# EAGLE design BPW5017-VGA (EAGLE 5.06)
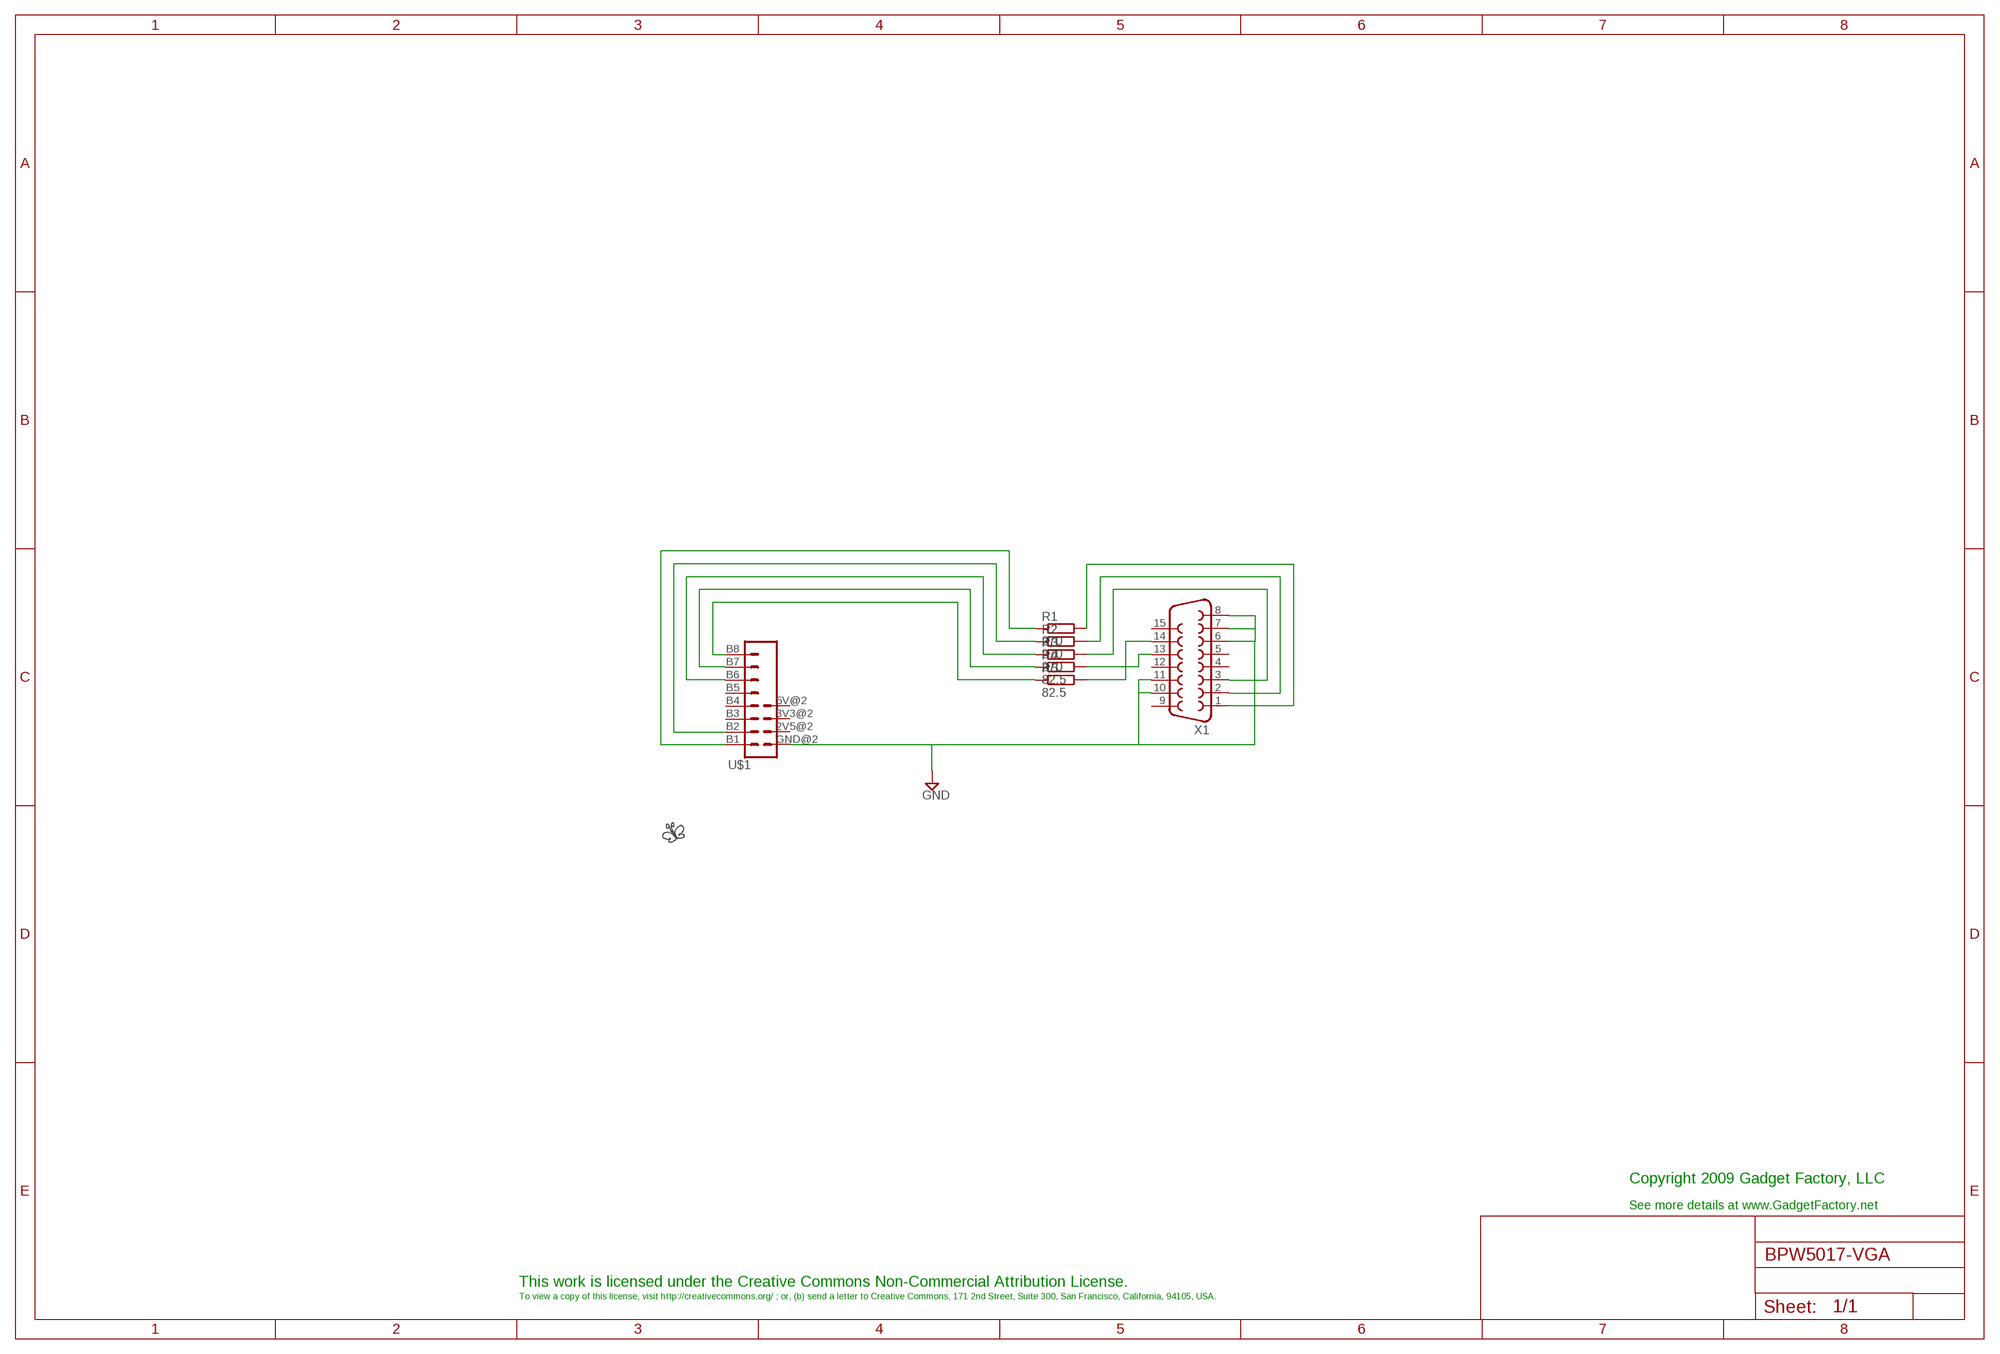
[diagram p0: schematic, sheet 1]

## Parts
LOGO2  BUTTERFLY_LOGO  [BUTTERFLY_LOGO]
R1  270  R-EU_0207/10  [0207/10]
R2  270  R-EU_0207/10  [0207/10]
R3  270  R-EU_0207/10  [0207/10]
R4  82.5  R-EU_0207/10  [0207/10]
R5  82.5  R-EU_0207/10  [0207/10]
U$1  WING_8BIT  [WINGSIDE_8BIT]
X1  F15HDH  [HDF15H]

## Nets
GND: U$1.GND@2(GND) X1.6 X1.7 X1.8 X1.10 X1.11
N$1: R1.2 X1.1
N$2: R2.2 X1.2
N$3: R3.2 X1.3
N$4: R4.2 X1.13
N$5: R5.2 X1.14
N$6: R1.1 U$1.B1
N$7: R2.1 U$1.B2
N$8: R3.1 U$1.B6
N$9: R4.1 U$1.B7
N$12: R5.1 U$1.B8
Unconnected: U$1.2V5@2(2V5) U$1.3V3@2(3V3) U$1.5V@2(5V) U$1.B3 U$1.B4 U$1.B5 X1.4 X1.5 X1.9 X1.12 X1.15

## Notes on the sheet
- Copyright 2009 Gadget Factory, LLC
- See more details at www.GadgetFactory.net
- This work is licensed under the Creative Commons Non-Commercial Attribution License.
- To view a copy of this license, visit http://creativecommons.org/ ; or, (b) send a letter to Creative Commons, 171 2nd Street, Suite 300, San Francisco, California, 94105, USA.

## Library data of the parts
LOGO2 = GadgetFactory_Pub:BUTTERFLY_LOGO
R1-R5 = resistor:R-EU_: RESISTOR, European symbol
U$1 = GadgetFactory_Pub:WING_8BIT
X1 = con-subd:F15: SUB-D

## Board
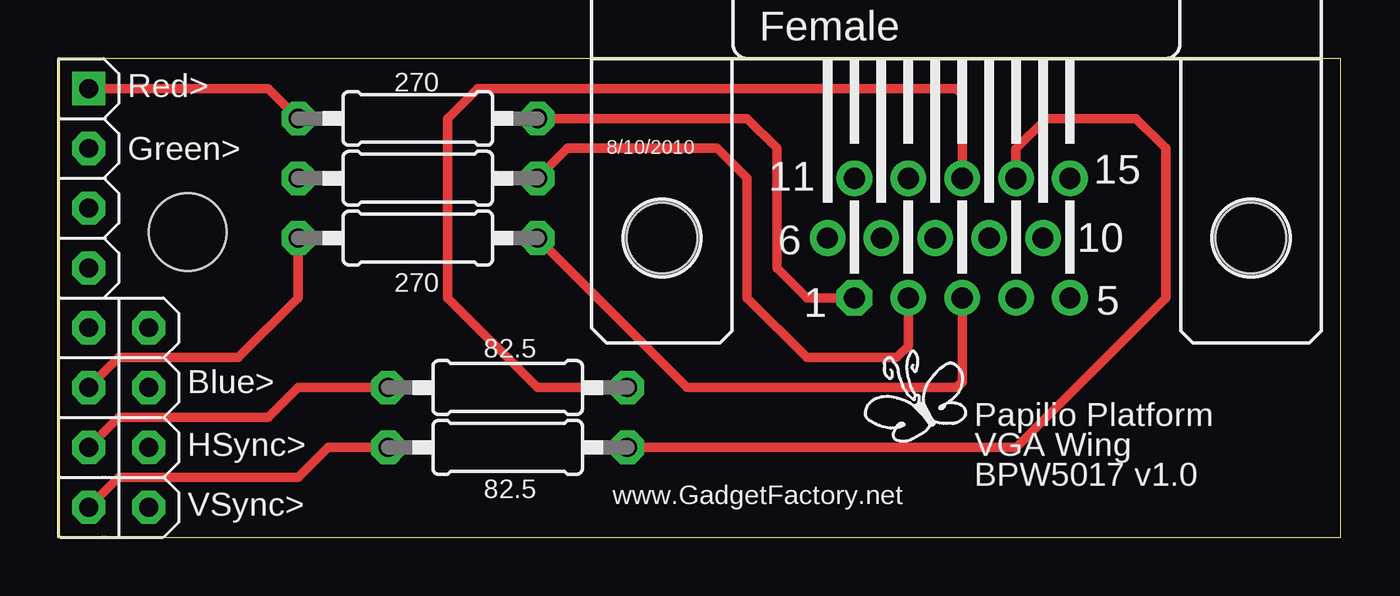
[diagram p1: board, top side]
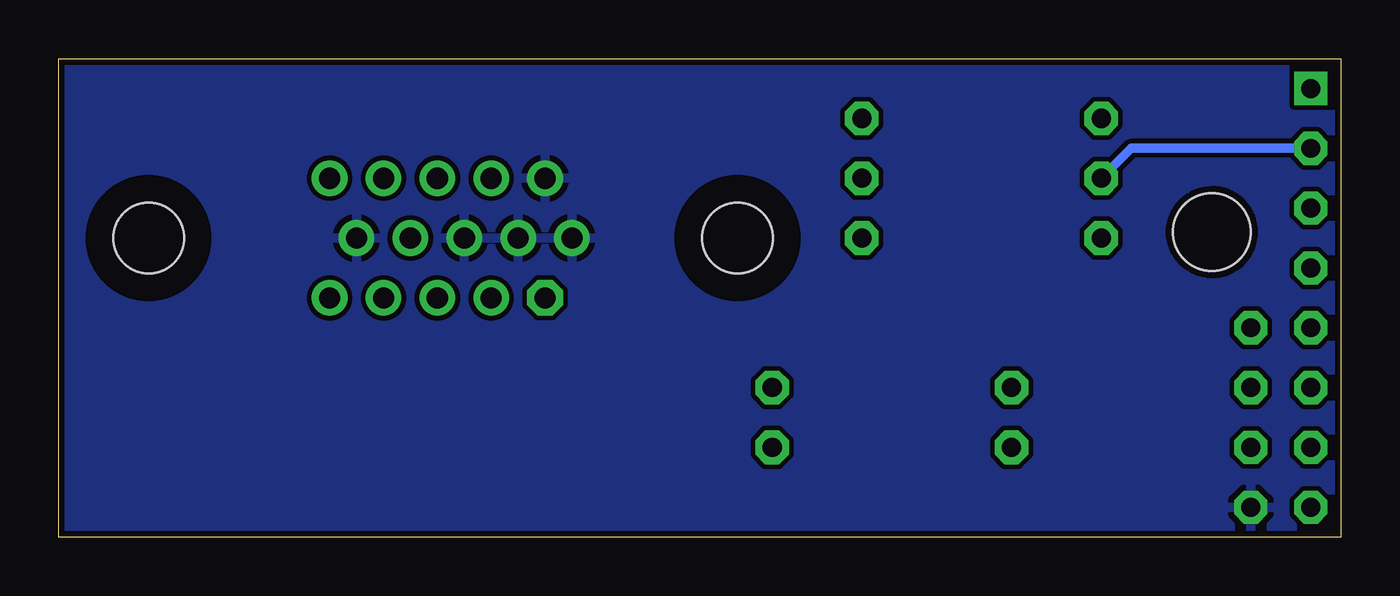
[diagram p2: board, bottom side, seen from below]

Size 54.41 x 20.31 mm. Coordinates in mm from the lower left corner, seen from the top.
Outline: 0,0 54.41,0 54.41,20.31 0,20.31 0,0
Copper layers (1*16): Top 0.035mm / dielectric 1.5mm / Bottom 0.035mm
Design rules "SparkFun_Derived_GoldePheonix_10mil": minimum track width 10mil, minimum drill 15mil, track to track 8mil, track to pad 8mil, pad to pad 8mil, via to via 8mil, smd to smd 8mil, copper to edge 10mil, drill to drill 8mil, minimum pad ring 12mil, minimum via ring 10mil, stop-mask expansion 4mil, vias tented up to drill 18mil, thermal gap 10mil

### Footprints (pad centres in the part's own frame; a part is rotated, then mirrored left to right if it is on the bottom)
0207/10 = drill 0.813 octagon: 1 -5.08,0; 2 5.08,0
WINGSIDE_8BIT = drill 0.8 octagon: 2V5@2 16.51,3.81; 3V3@2 13.97,3.81; 5V@2 11.43,3.81; B2 3.81,1.27; B3 6.35,1.27; B4 8.89,1.27; B5 11.43,1.27; B6 13.97,1.27; B7 16.51,1.27; B8 19.05,1.27; GND@2 19.05,3.81 | drill 0.8 square: B1 1.27,1.27 | hole 3.302: 7.366,5.461
HDF15H = drill 0.9 octagon: 1 4.329,2.54 | drill 0.9 round: 2 2.043,2.54; 3 -0.243,2.54; 4 -2.529,2.54; 5 -4.815,2.54; 6 5.472,0; 7 3.186,0; 8 0.9,0; 9 -1.386,0; 10 -3.672,0; 11 4.329,-2.54; 12 2.043,-2.54; 13 -0.243,-2.54; 14 -2.529,-2.54; 15 -4.815,-2.54 | hole 3: -12.5,0; 12.5,0

### Placement (x,y rotation side)
LOGO2  36.45,5.46 0 top
R1  15.24,17.78 0 top
R2  15.24,15.24 0 top
R3  15.24,12.7 0 top
R4  19.05,6.35 0 top
R5  19.05,3.81 0 top
U$1  0,20.32 270 top
X1  38.1,12.7 180 top

### Tracks (layer width: path | path; a pad name or v marks a point on that pad's centre or on a via)
GND
  pour Bottom: 0,20.32 54.61,20.32 54.61,0 0,0
N$1
  Top 0.406: X1.1 31.75,10.16 30.48,11.43 30.48,16.51 29.21,17.78 R1.2
N$2
  Top 0.406: X1.2 36.06,8.12 35.56,7.62 31.75,7.62 29.21,10.16 29.21,15.24 27.94,16.51 21.59,16.51 R2.2
N$3
  Top 0.406: X1.3 38.34,6.59 38.1,6.35 26.67,6.35 R3.2
N$4
  Top 0.406: X1.13 38.34,18.81 38.1,19.05 17.78,19.05 16.51,17.78 16.51,10.16 20.32,6.35 R4.2
N$5
  Top 0.406: X1.14 40.63,16.5 41.91,17.78 45.72,17.78 46.99,16.51 46.99,10.16 40.64,3.81 R5.2
N$6
  Top 0.406: U$1.B1 8.89,19.05 R1.1
N$7
  Bottom 0.406: R2.1 8.89,16.51 U$1.B2
N$8
  Top 0.406: R3.1 10.16,10.16 7.62,7.62 2.54,7.62 U$1.B6
N$9
  Top 0.406: U$1.B7 2.54,5.08 8.89,5.08 10.16,6.35 R4.1
N$12
  Top 0.406: U$1.B8 2.54,2.54 10.16,2.54 11.43,3.81 R5.1

### Text on the board
tPlace: Red> | 270 | Green> | 8/10/2010 | 270 | 82.5 | Blue> | Papilio Platform | HSync> | VGA Wing | 82.5 | BPW5017 v1.0 | VSync> | www.GadgetFactory.net